# Altium schematic sheet P21_HDMI OUT.SchDoc
size 420 x 297 mm
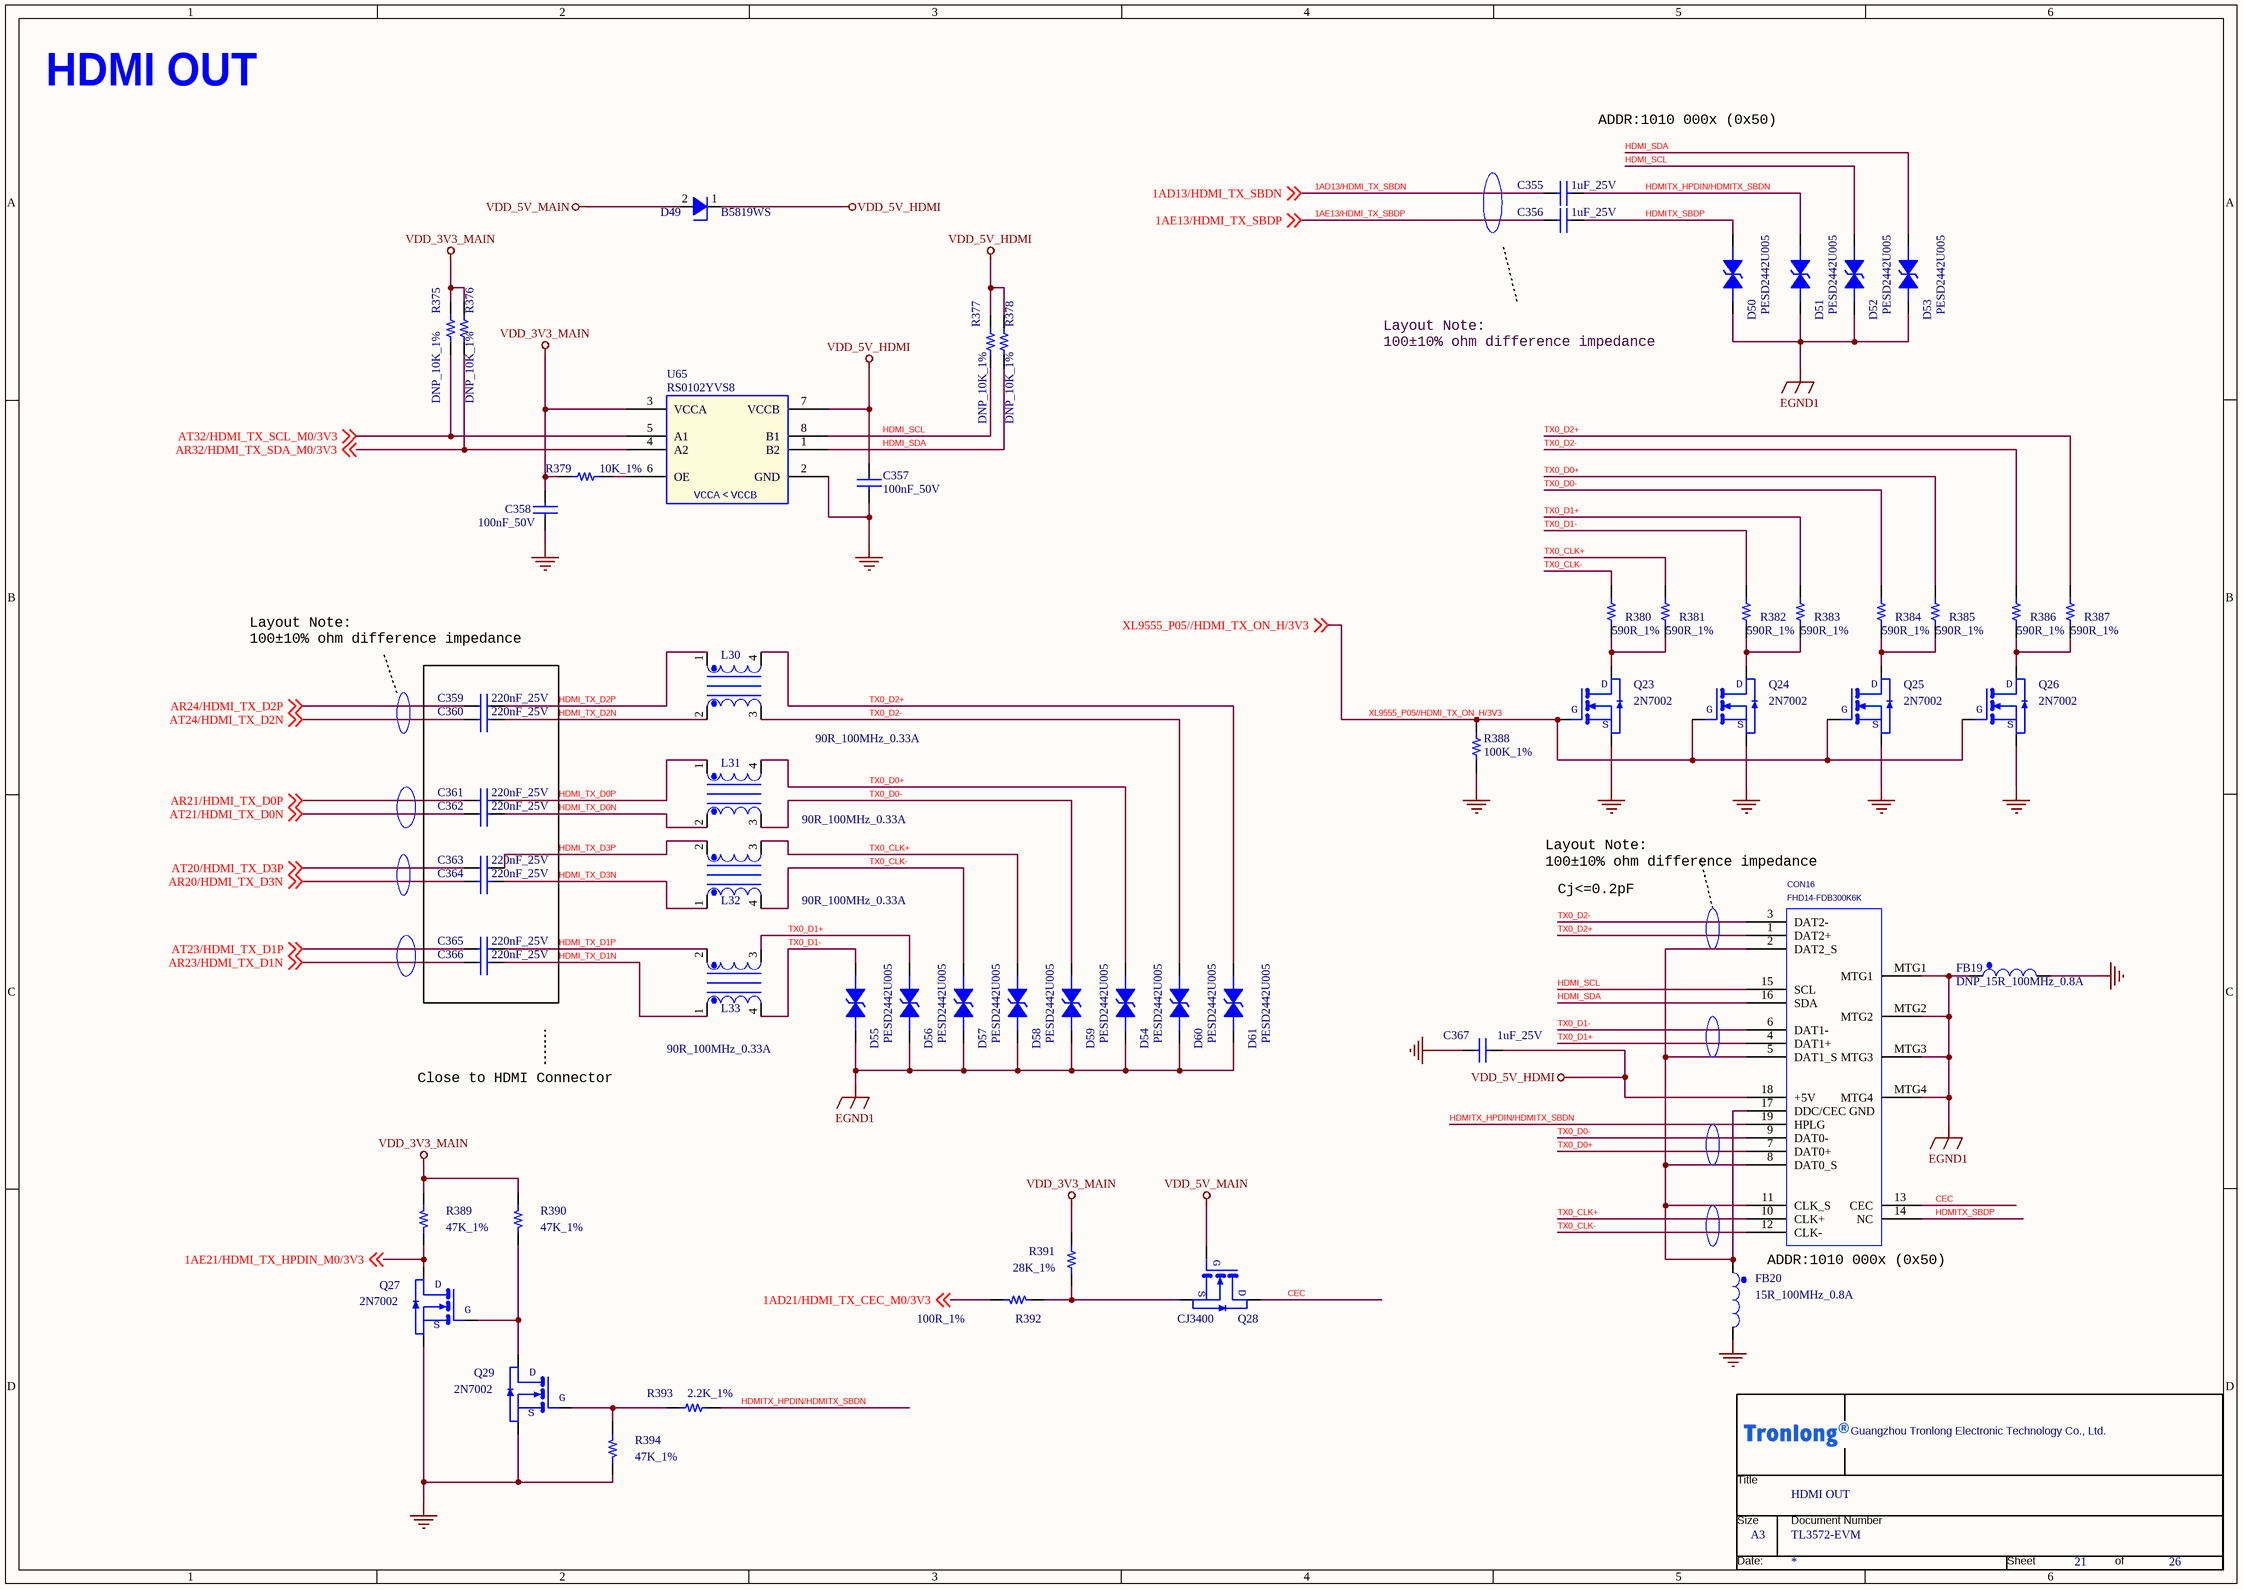
[diagram p0: P21_HDMI OUT.SchDoc]

## Parts
*  Doc: TL3572-EVM  Title: HDMI OUT  OrgName: Guangzhou Tronlong Electronic Technology Co., Ltd.  Page Size: A3  Page Number: 21  Page Count: 26  (hidden comment: Tronlong_TITTLE_20211115)  (graphical)
C355  1uF_25V  [C0402]
C356  1uF_25V  [C0402]
C357  100nF_50V  [C0402]
C358  100nF_50V  [C0402]
C359  220nF_25V  [C0402]
C360  220nF_25V  [C0402]
C361  220nF_25V  [C0402]
C362  220nF_25V  [C0402]
C363  220nF_25V  [C0402]
C364  220nF_25V  [C0402]
C365  220nF_25V  [C0402]
C366  220nF_25V  [C0402]
C367  1uF_25V  [C0402]
CON16  FHD14-FDB300K6K  [DIP_HDMI-A]
D49  B5819WS  [SOD-323]
D50  PESD2442U005  [ESD_0402]
D51  PESD2442U005  [ESD_0402]
D52  PESD2442U005  [ESD_0402]
D53  PESD2442U005  [ESD_0402]
D54  PESD2442U005  [ESD_0402]
D55  PESD2442U005  [ESD_0402]
D56  PESD2442U005  [ESD_0402]
D57  PESD2442U005  [ESD_0402]
D58  PESD2442U005  [ESD_0402]
D59  PESD2442U005  [ESD_0402]
D60  PESD2442U005  [ESD_0402]
D61  PESD2442U005  [ESD_0402]
FB19  DNP_15R_100MHz_0.8A  [L0603]
FB20  15R_100MHz_0.8A  [L0603]
L30  90R_100MHz_0.33A  [SMD-L2012M-4P]
L31  90R_100MHz_0.33A  [SMD-L2012M-4P]
L32  90R_100MHz_0.33A  [SMD-L2012M-4P]
L33  90R_100MHz_0.33A  [SMD-L2012M-4P]
Q23  2N7002  [SOT23-3_DBZ3]
Q24  2N7002  [SOT23-3_DBZ3]
Q25  2N7002  [SOT23-3_DBZ3]
Q26  2N7002  [SOT23-3_DBZ3]
Q27  2N7002  [SOT23-3_DBZ3]
Q28  CJ3400  [SOT23-3]
Q29  2N7002  [SOT23-3_DBZ3]
R375  DNP_10K_1%  [R0402]
R376  DNP_10K_1%  [R0402]
R377  DNP_10K_1%  [R0402]
R378  DNP_10K_1%  [R0402]
R379  10K_1%  [R0402]
R380  590R_1%  [R0402]
R381  590R_1%  [R0402]
R382  590R_1%  [R0402]
R383  590R_1%  [R0402]
R384  590R_1%  [R0402]
R385  590R_1%  [R0402]
R386  590R_1%  [R0402]
R387  590R_1%  [R0402]
R388  100K_1%  [R0402]
R389  47K_1%  [R0402]
R390  47K_1%  [R0402]
R391  28K_1%  [R0402]
R392  100R_1%  [R0402]
R393  2.2K_1%  [R0603]
R394  47K_1%  [R0402]
U65  RS0102YVS8  [SOP8-20-91]

## Nets
EGND1: CON16.MTG1 CON16.MTG2 CON16.MTG3 CON16.MTG4 D50.2 D51.2 D52.2 D53.2 D54.2 D55.2 D56.2 D57.2 D58.2 D59.2 D60.2 D61.2 FB19.1
GND: C357.2 C358.2 C367.1 FB19.2 FB20.2 Q23.2(E) Q24.2(E) Q25.2(E) Q26.2(E) Q27.2(E) Q29.2(E) R388.1 R394.2 U65.2(GND)
VDD_3V3_MAIN: C358.1 R375.1 R376.1 R379.1 R389.1 R390.1 R391.2 U65.3(VCCA)
VDD_5V_HDMI: C357.1 C367.2 CON16.18(+5V) D49.1(Cathode) R377.1 R378.1 U65.7(VCCB)
VDD_5V_MAIN: D49.2(Anode) Q28.1(B)
1AD13/HDMI_TX_SBDN: C355.1 ; off-sheet 1AD13/HDMI_TX_SBDN
1AD21/HDMI_TX_CEC_M0/3V3: R392.2 ; off-sheet 1AD21/HDMI_TX_CEC_M0/3V3
1AE13/HDMI_TX_SBDP: C356.1 ; off-sheet 1AE13/HDMI_TX_SBDP
1AE21/HDMI_TX_HPDIN_M0/3V3: Q27.3(C) R389.2 ; off-sheet 1AE21/HDMI_TX_HPDIN_M0/3V3
AR20/HDMI_TX_D3N: C364.1 ; off-sheet AR20/HDMI_TX_D3N
AR21/HDMI_TX_D0P: C361.1 ; off-sheet AR21/HDMI_TX_D0P
AR23/HDMI_TX_D1N: C366.1 ; off-sheet AR23/HDMI_TX_D1N
AR24/HDMI_TX_D2P: C359.1 ; off-sheet AR24/HDMI_TX_D2P
AR32/HDMI_TX_SDA_M0/3V3: R376.2 U65.4(A2) ; off-sheet AR32/HDMI_TX_SDA_M0/3V3
AT20/HDMI_TX_D3P: C363.1 ; off-sheet AT20/HDMI_TX_D3P
AT21/HDMI_TX_D0N: C362.1 ; off-sheet AT21/HDMI_TX_D0N
AT23/HDMI_TX_D1P: C365.1 ; off-sheet AT23/HDMI_TX_D1P
AT24/HDMI_TX_D2N: C360.1 ; off-sheet AT24/HDMI_TX_D2N
AT32/HDMI_TX_SCL_M0/3V3: R375.2 U65.5(A1) ; off-sheet AT32/HDMI_TX_SCL_M0/3V3
CEC: CON16.13(CEC) Q28.3(C)
HDMI_SCL: CON16.15(SCL) D52.1 R377.2 U65.8(B1)
HDMI_SDA: CON16.16(SDA) D53.1 R378.2 U65.1(B2)
HDMI_TX_D0N: C362.2 L31.2
HDMI_TX_D0P: C361.2 L31.1
HDMI_TX_D1N: C366.2 L33.1
HDMI_TX_D1P: C365.2 L33.2
HDMI_TX_D2N: C360.2 L30.2
HDMI_TX_D2P: C359.2 L30.1
HDMI_TX_D3N: C364.2 L32.1
HDMI_TX_D3P: C363.2 L32.2
HDMITX_HPDIN/HDMITX_SBDN: C355.2 CON16.19(HPLG) D51.1 R393.2
HDMITX_SBDP: C356.2 CON16.14(NC) D50.1
TX0_CLK+: CON16.10(CLK+) D58.1 L32.3 R381.1
TX0_CLK-: CON16.12(CLK-) D57.1 L32.4 R380.1
TX0_D0+: CON16.7(DAT0+) D54.1 L31.4 R385.1
TX0_D0-: CON16.9(DAT0-) D59.1 L31.3 R384.1
TX0_D1+: CON16.4(DAT1+) D56.1 L33.3 R383.1
TX0_D1-: CON16.6(DAT1-) D55.1 L33.4 R382.1
TX0_D2+: CON16.1(DAT2+) D61.1 L30.4 R387.1
TX0_D2-: CON16.3(DAT2-) D60.1 L30.3 R386.1
XL9555_P05//HDMI_TX_ON_H/3V3: Q23.1(B) Q24.1(B) Q25.1(B) Q26.1(B) R388.2 ; off-sheet XL9555_P05//HDMI_TX_ON_H/3V3
NetCON16_2: CON16.2(DAT2_S) CON16.5(DAT1_S) CON16.8(DAT0_S) CON16.11(CLK_S) CON16.17(DDC/CEC_GND) FB20.1
NetQ23_3: Q23.3(C) R380.2 R381.2
NetQ24_3: Q24.3(C) R382.2 R383.2
NetQ25_3: Q25.3(C) R384.2 R385.2
NetQ26_3: Q26.3(C) R386.2 R387.2
NetQ27_1: Q27.1(B) Q29.3(C) R390.2
NetQ28_2: Q28.2(E) R391.1 R392.1
NetQ29_1: Q29.1(B) R393.1 R394.1
NetR379_2: R379.2 U65.6(OE)

## Notes on the sheet
- HDMI OUT
- ADDR:1010 000x (0x50)
- (near D50) Layout Note:
  100±10% ohm difference impedance
- Layout Note:
  100±10% ohm difference impedance
- Cj<=0.2pF
- Close to HDMI Connector
- (in symbol MMBT3904/SOT_1) D; G; S
- (in symbol MOSFET N SOT) G; D; S
- (in symbol Tronlong_TITTLE_20211115) Title; Size; Document Number; Date:; Sheet; of
- (in symbol TXS0102DCUR_0) VCCA＜VCCB

## Library data of the parts
* = Tronlong_TITTLE_20211115: RevCode: A?; Page Create Date: March  8, 1995; Page Modify Date: *
C355 C356 = CAP NP_Dup3: 贴片陶瓷电容,1uF,10%,25V,X5R; Manufacturer Character: 中国大陆; Manufacturer PartNumber: 0402X105K250NT; Manufacturer: 广东风华高新科技股份有限公司（FH）; Eco-Label: ROHS; ERP Number: 005.0001.0001.00640; As-Welded: /; Voltage: 50V; Operation Temperature（℃）: -55~+85(Ta); Part Status: 试用; Height: 0.55MM; PCB Footprint: C0402
C357 C358 = CAP NP_Dup3: 贴片陶瓷电容,100nF,10%,50V,X7R; Manufacturer Character: 中国大陆; Manufacturer PartNumber: 0402B104K500NT; Manufacturer: 广东风华高新科技股份有限公司（FH）; Eco-Label: ROHS; ERP Number: 005.0001.0001.00681; Operation Temperature（℃）: -55~+125(Ta); As-Welded: /; Part Status: 试用; PCB Footprint: C0402
C359 C360 = CAP NP_Dup3: 贴片陶瓷电容,220nF,10%,25V,X5R; Manufacturer: 广东风华高新科技股份有限公司（FH）; Manufacturer PartNumber: 0402X224K250NT; Manufacturer Character: 中国大陆; Voltage: 50V; Operation Temperature（℃）: -55~+85(Ta); As-Welded: /; ERP Number: 005.0001.0001.00642; Eco-Label: ROHS; Part Status: 试用; Height: 0.55MM; PCB Footprint: C0402
C361 = CAP NP_Dup3: 贴片陶瓷电容,220nF,10%,25V,X5R; Manufacturer Character: 中国大陆; Manufacturer PartNumber: 0402X224K250NT; Manufacturer: 广东风华高新科技股份有限公司（FH）; Eco-Label: ROHS; ERP Number: 005.0001.0001.00642; As-Welded: /; Voltage: 50V; Operation Temperature（℃）: -55~+85(Ta); Height: 0.55MM; Part Status: 试用; PCB Footprint: C0402
C362 C364 = CAP NP_Dup3: 贴片陶瓷电容,220nF,10%,25V,X5R; Manufacturer Character: 中国大陆; Manufacturer PartNumber: 0402X224K250NT; Manufacturer: 广东风华高新科技股份有限公司（FH）; Eco-Label: ROHS; ERP Number: 005.0001.0001.00642; As-Welded: /; Operation Temperature（℃）: -55~+85(Ta); Voltage: 50V; Height: 0.55MM; Part Status: 试用; PCB Footprint: C0402
C363 C365 = CAP NP_Dup3: 贴片陶瓷电容,220nF,10%,25V,X5R; Manufacturer Character: 中国大陆; Manufacturer PartNumber: 0402X224K250NT; Manufacturer: 广东风华高新科技股份有限公司（FH）; Eco-Label: ROHS; ERP Number: 005.0001.0001.00642; Operation Temperature（℃）: -55~+85(Ta); Voltage: 50V; As-Welded: /; Height: 0.55MM; Part Status: 试用; PCB Footprint: C0402
C366 = CAP NP_Dup3: 贴片陶瓷电容,220nF,10%,25V,X5R; Manufacturer Character: 中国大陆; Manufacturer PartNumber: 0402X224K250NT; Manufacturer: 广东风华高新科技股份有限公司（FH）; Eco-Label: ROHS; ERP Number: 005.0001.0001.00642; Voltage: 50V; Operation Temperature（℃）: -55~+85(Ta); As-Welded: /; Height: 0.55MM; Part Status: 试用; PCB Footprint: C0402
C367 = CAP NP_Dup2: 贴片陶瓷电容,1uF,10%,25V,X5R; Manufacturer PartNumber: 0402X105K250NT; Manufacturer: 广东风华高新科技股份有限公司（FH）; Manufacturer Character: 中国大陆; As-Welded: /; Operation Temperature（℃）: -55~+85(Ta); ERP Number: 005.0001.0001.00640; Eco-Label: ROHS; Part Status: 试用; PCB Footprint: C0402
CON16 = 2C_Conn_HDMI_TypeA: 插件HDMI座,A型,19P,侧立; TIIntPartnumber: 2C0085; MfrNum: 10029449-001RLF; Mfr: FCI; PartName: Conn_HDMI_A; Manufacturer: 深圳特思嘉工业电子有限公司（TXGA）; Manufacturer Character: 中国大陆; PCB Footprint: SMD_Ratbd; Cost10K: 0.37; Cost100: 0.91; Vendor: Digikey; DescriptiveText: Connector HDMI Type A RA; Eco-Label: ROHS; ERP Number: 005.0001.0003.00449; As-Welded: /; Operation Temperature（℃）: -40~+85(Ta); Manufacturer PartNumber: FHD14-FDB300K6K; Temperature: -40~85℃; Part Status: 优选
D49 = DIODE-1N: 肖特基二极管,VR=40V,IF=1A,VF=0.6V@1A; PartName: Diode200mA250V; Mfr: On Semiconductor; MfrNum: MMSD103T1G; TIIntPartnumber: 1E0013; Manufacturer Character: 中国大陆; Manufacturer: 江苏长晶科技股份有限公司（JSCJ）; Descriptive_Text: Diode 200mA 250V 1.25V Forward Drop; Vendor: Digikey; Cost100: 0.23; Cost10K: 0.07; PCB Footprint: smd123; Operation Temperature（℃）: -55~+125(Tj); As-Welded: /; ERP Number: 005.0001.0010.00093; Eco-Label: ROHS; DescriptiveText: Diode 200mA 250V 1.25V Forward Drop; Manufacturer PartNumber: B5819WS; Temperature: -55~150℃; Part Status: 优选
D50 = DIODE-TRIG: ESD二极管,VRWM=24V,VBR=300V,一组,双向,8KV,15KV; Manufacturer: 上海雷卯电子科技有限公司（Leiditech）; Manufacturer Character: 中国大陆; Operation Temperature（℃）: -40~+90(Tj); As-Welded: /; ERP Number: 005.0001.0017.00056; Eco-Label: ROHS; Temperature: -55~125℃; Manufacturer PartNumber: PESD2442U005; Part Status: 优选; PCB Footprint: ESD_0402
D51 D53 D54 D57-D59 D61 = DIODE-TRIG: ESD二极管,VRWM=24V,VBR=300V,一组,双向,8KV,15KV; Manufacturer Character: 中国大陆; Manufacturer: 上海雷卯电子科技有限公司（Leiditech）; Eco-Label: ROHS; ERP Number: 005.0001.0017.00056; As-Welded: /; Operation Temperature（℃）: -40~+90(Tj); Part Status: 优选; Manufacturer PartNumber: PESD2442U005; Temperature: -55~125℃; PCB Footprint: ESD_0402
D52 D55 D56 D60 = DIODE-TRIG: ESD二极管,VRWM=24V,VBR=300V,一组,双向,8KV,15KV; Manufacturer: 上海雷卯电子科技有限公司（Leiditech）; Manufacturer Character: 中国大陆; Eco-Label: ROHS; ERP Number: 005.0001.0017.00056; As-Welded: /; Operation Temperature（℃）: -40~+90(Tj); Part Status: 优选; Temperature: -55~125℃; Manufacturer PartNumber: PESD2442U005; PCB Footprint: ESD_0402
FB19 = FB_0: 磁珠,100mΩ,0.8A,15R@100MHz; Manufacturer: 广东风华高新科技股份有限公司(FH); Manufacturer PartNumber: CBG160808U150T; Manufacturer Character: 中国大陆; Eco-Label: ROHS; ERP Number: 005.0001.0007.00013; As-Welded: DNP; Operation Temperature（℃）: -40~+85(Ta); Temperature: -40~85℃; Part Status: 试用; PCB Footprint: L0603
FB20 = FB_0: 磁珠,100mΩ,0.8A,15R@100MHz; Manufacturer Character: 中国大陆; Manufacturer PartNumber: CBG160808U150T; Manufacturer: 广东风华高新科技股份有限公司(FH); Operation Temperature（℃）: -40~+85(Ta); As-Welded: /; ERP Number: 005.0001.0007.00013; Eco-Label: ROHS; Temperature: -40~85℃; Part Status: 试用; PCB Footprint: L0603
L30 L31 L33 = TFR_AXA_A_1: 贴片共模电感,350mΩ,0.33A,50V,90Ω@100MHz; Manufacturer Character: 中国大陆; Manufacturer: 深圳顺络电子股份有限公司（Sunlord）; Manufacturer PartNumber: SDCW2012-2-900TF; Eco-Label: ROHS; As-Welded: /; Operation Temperature（℃）: -40~+85(Ta); ERP Number: 005.0001.0006.00172; Part Status: 测评; PCB Footprint: SMD-L2012M-4P
L32 = TFR_AXA_A_1: 贴片共模电感,350mΩ,0.33A,50V,90Ω@100MHz; Manufacturer PartNumber: SDCW2012-2-900TF; Manufacturer: 深圳顺络电子股份有限公司（Sunlord）; Manufacturer Character: 中国大陆; Eco-Label: ROHS; ERP Number: 005.0001.0006.00172; Operation Temperature（℃）: -40~+85(Ta); As-Welded: /; Part Status: 测评; PCB Footprint: SMD-L2012M-4P
Q23 = MMBT3904/SOT_1: MOSFET,N沟道,VDSS=60V,VGSS=±20V,ID=0.115A,PD=0.225W,VGS(th)=1.6V; Manufacturer Character: 中国大陆; Manufacturer: 江苏长晶科技股份有限公司（JSCJ）; Eco-Label: ROHS; ERP Number: 005.0001.0009.00012; As-Welded: /; ROOM: DSP_LED; Operation Temperature（℃）: -55~+150(Tj); Part Status: 试用; Manufacturer PartNumber: 2N7002; PCB Footprint: SOT23-3_DBZ3
Q24-Q26 = MMBT3904/SOT_1: MOSFET,N沟道,VDSS=60V,VGSS=±20V,ID=0.115A,PD=0.225W,VGS(th)=1.6V; Manufacturer: 江苏长晶科技股份有限公司（JSCJ）; Manufacturer Character: 中国大陆; Operation Temperature（℃）: -55~+150(Tj); ROOM: DSP_LED; As-Welded: /; ERP Number: 005.0001.0009.00012; Eco-Label: ROHS; Manufacturer PartNumber: 2N7002; Part Status: 试用; PCB Footprint: SOT23-3_DBZ3
Q27 = MMBT3904/SOT_1: MOSFET,N沟道,VDSS=60V,VGSS=±20V,ID=0.115A,PD=0.225W,VGS(th)=1.6V; Manufacturer: 江苏长晶科技股份有限公司（JSCJ）; Manufacturer Character: 中国大陆; Eco-Label: ROHS; ERP Number: 005.0001.0009.00012; As-Welded: /; Operation Temperature（℃）: -55~+150(Tj); ROOM: DSP_LED; PCB Footprint: SOT23-3_DBZ3; Manufacturer PartNumber: 2N7002; Part Status: 试用
Q28 = MOSFET N SOT: MOSFET,N沟道,VDSS=30V,VGSS=±12V,ID=5.8A,PD=0.35W,VGS(th)=1.4V; Manufacturer Character: 中国大陆; Manufacturer: 江苏长晶科技股份有限公司（JSCJ）; As-Welded: /; ROOM: DSP_LED; Operation Temperature（℃）: -55~+150(Tj); ERP Number: 005.0001.0009.00027; Eco-Label: ROHS; PCB Footprint: SOT23-3; Part Status: 优选; Temperature: -55~150℃; Manufacturer PartNumber: CJ3400
Q29 = MMBT3904/SOT_1: MOSFET,N沟道,VDSS=60V,VGSS=±20V,ID=0.115A,PD=0.225W,VGS(th)=1.6V; Manufacturer Character: 中国大陆; Manufacturer: 江苏长晶科技股份有限公司（JSCJ）; ROOM: DSP_LED; Operation Temperature（℃）: -55~+150(Tj); As-Welded: /; ERP Number: 005.0001.0009.00012; Eco-Label: ROHS; PCB Footprint: SOT23-3_DBZ3; Manufacturer PartNumber: 2N7002; Part Status: 试用
R375 = Resistor_Dup4: 贴片电阻,10K,±1%,1/16W; Manufacturer Character: 中国大陆; Manufacturer: 广东风华高新科技股份有限公司（FH）; Manufacturer PartNumber: RC-02K1002FT; CLASS: DISCRETE; DNP: /; Operation Temperature（℃）: -55~+125(Ta); As-Welded: DNP; ERP Number: 005.0001.0002.01326; Eco-Label: ROHS; Temperature: -55~155℃; Part Status: 优选; PCB Footprint: R0402
R376 = Resistor_Dup4: 贴片电阻,10K,±1%,1/16W; Manufacturer: 广东风华高新科技股份有限公司（FH）; Manufacturer PartNumber: RC-02K1002FT; Manufacturer Character: 中国大陆; CLASS: DISCRETE; Eco-Label: ROHS; ERP Number: 005.0001.0002.01326; As-Welded: DNP; Operation Temperature（℃）: -55~+125(Ta); DNP: /; Part Status: 优选; Temperature: -55~155℃; PCB Footprint: R0402
R377 = Resistor_Dup4: 贴片电阻,10K,±1%,1/16W; Manufacturer Character: 中国大陆; Manufacturer PartNumber: RC-02K1002FT; Manufacturer: 广东风华高新科技股份有限公司（FH）; CLASS: DISCRETE; Eco-Label: ROHS; ERP Number: 005.0001.0002.01326; As-Welded: DNP; DNP: /; Operation Temperature（℃）: -55~+125(Ta); Temperature: -55~155℃; Part Status: 优选; PCB Footprint: R0402
R378 = Resistor_Dup4: 贴片电阻,10K,±1%,1/16W; Manufacturer Character: 中国大陆; Manufacturer PartNumber: RC-02K1002FT; Manufacturer: 广东风华高新科技股份有限公司（FH）; CLASS: DISCRETE; As-Welded: /; Operation Temperature（℃）: -55~+125(Ta); ERP Number: 005.0001.0002.01326; Eco-Label: ROHS; Part Status: 优选; DNP: /; Temperature: -55~155℃; PCB Footprint: R0402
R379 = Resistor_Dup4: 贴片电阻,10K,±1%,1/16W; Manufacturer Character: 中国大陆; Manufacturer PartNumber: RC-02K1002FT; Manufacturer: 广东风华高新科技股份有限公司（FH）; CLASS: DISCRETE; Operation Temperature（℃）: -55~+125(Ta); As-Welded: /; ERP Number: 005.0001.0002.01326; Eco-Label: ROHS; Part Status: 优选; PCB Footprint: R0402
R380 R385-R387 = Resistor_Dup4: 贴片电阻,590R,±1%,1/16W; Manufacturer: 广东风华高新科技股份有限公司（FH）; Manufacturer PartNumber: RC-02K5900FT; Manufacturer Character: 中国大陆; CLASS: DISCRETE; As-Welded: /; Operation Temperature（℃）: -55~+125(Ta); ERP Number: 005.0001.0002.01307; Eco-Label: ROHS; Part Status: 试用; PCB Footprint: R0402
R381-R384 = Resistor_Dup4: 贴片电阻,590R,±1%,1/16W; Manufacturer Character: 中国大陆; Manufacturer PartNumber: RC-02K5900FT; Manufacturer: 广东风华高新科技股份有限公司（FH）; CLASS: DISCRETE; Operation Temperature（℃）: -55~+125(Ta); As-Welded: /; ERP Number: 005.0001.0002.01307; Eco-Label: ROHS; Part Status: 试用; PCB Footprint: R0402
R388 = Resistor_Dup4: RC0402FR-07100KL,0402WGF1003TCE; Manufacturer PartNumber: 100K,±1%,R0402,≥1/16W; Manufacturer: 广州创龙; CLASS: DISCRETE; Eco-Label: ROHS; ERP Number: 005.0001.0023.00025; As-Welded: /; Operation Temperature（℃）: -40~+85(Ta); Purchase Information: 13510796878 伊美尔电子; Standard PCB Footprint: 603; PCB Footprint Status: Checked; Tolerance: 5%; Temperature: -55~155℃; Part Status: -; Price: 0.0028; Part Type: RESISTOR; Part Number: 737-00-3066; Manufacturer Character: -; PCB Footprint: R0402
R389 = Resistor_Dup4: 贴片电阻,47K,±1%,1/16W; Manufacturer: 广东风华高新科技股份有限公司（FH）; Manufacturer PartNumber: RC-02K4702FT; Manufacturer Character: 中国大陆; CLASS: DISCRETE; Eco-Label: ROHS; ERP Number: 005.0001.0002.01331; As-Welded: /; Operation Temperature（℃）: -55~+125(Ta); PCB Footprint: R0402; Temperature: -55~155℃; Part Status: 试用
R390 = Resistor_Dup4: 贴片电阻,47K,±1%,1/16W; Manufacturer Character: 中国大陆; Manufacturer PartNumber: RC-02K4702FT; Manufacturer: 广东风华高新科技股份有限公司（FH）; CLASS: DISCRETE; Eco-Label: ROHS; ERP Number: 005.0001.0002.01331; As-Welded: /; Operation Temperature（℃）: -55~+125(Ta); PCB Footprint: R0402; Temperature: -55~155℃; Part Status: 试用
R391 = Resistor_Dup3: 贴片电阻,28K,±1%,1/16W; Manufacturer PartNumber: RC-02K2802FT; Manufacturer: 广东风华高新科技股份有限公司（FH）; Manufacturer Character: 中国大陆; CLASS: DISCRETE; Eco-Label: ROHS; ERP Number: 005.0001.0002.01380; Operation Temperature（℃）: -55~+155(Ta); As-Welded: /; PCB Footprint: R0402; Part Status: 试用; Temperature: -55~155℃
R392 = Resistor_Dup3: 贴片电阻,100R,±1%,1/16W; Manufacturer: 广东风华高新科技股份有限公司（FH）; Manufacturer Character: 中国大陆; Manufacturer PartNumber: RC-02K1000FT; CLASS: DISCRETE; Eco-Label: ROHS; ERP Number: 005.0001.0002.01314; Operation Temperature（℃）: -55~+155(Ta); As-Welded: /; PCB Footprint: R0402; Part Status: 试用
R393 = Resistor_Dup4: 贴片电阻,2.2K,±1%,1/10W; Manufacturer: 广东风华高新科技股份有限公司（FH）; Manufacturer PartNumber: RS-03K2201FT; Manufacturer Character: 中国大陆; CLASS: DISCRETE; Eco-Label: ROHS; ERP Number: 005.0001.0002.00972; Operation Temperature（℃）: -55~+155(Ta); As-Welded: /; PCB Footprint: R0603; Part Status: 优选; Temperature: -55~155℃
R394 = Resistor_Dup4: 贴片电阻,47K,±1%,1/16W; Manufacturer: 广东风华高新科技股份有限公司（FH）; Manufacturer PartNumber: RC-02K4702FT; Manufacturer Character: 中国大陆; CLASS: DISCRETE; Operation Temperature（℃）: -55~+125(Ta); As-Welded: /; ERP Number: 005.0001.0002.01331; Eco-Label: ROHS; PCB Footprint: R0402; Temperature: -55~155℃; Part Status: 试用
U65 = TXS0102DCUR_0: 2位双向电平转换器; Manufacturer Character: 中国大陆; Manufacturer: 江苏润石科技有限公司（RUNIC）; Operation Temperature（℃）: -40~+85(Ta); As-Welded: /; ERP Number: 005.0001.0004.00890; Eco-Label: ROHS; PCB Footprint: SOP8-20-91; Manufacturer PartNumber: RS0102YVS8; Temperature: -40~85℃; Part Status: 试用